# EasyEDA Pro project PWM-24Route.eprj

# Schematic Schematic1
Create Date: 2022-10-05; Page Name: P1; Project Name: PWM-24Route; Schematic Name: Schematic1; Update Date: 2022-10-20
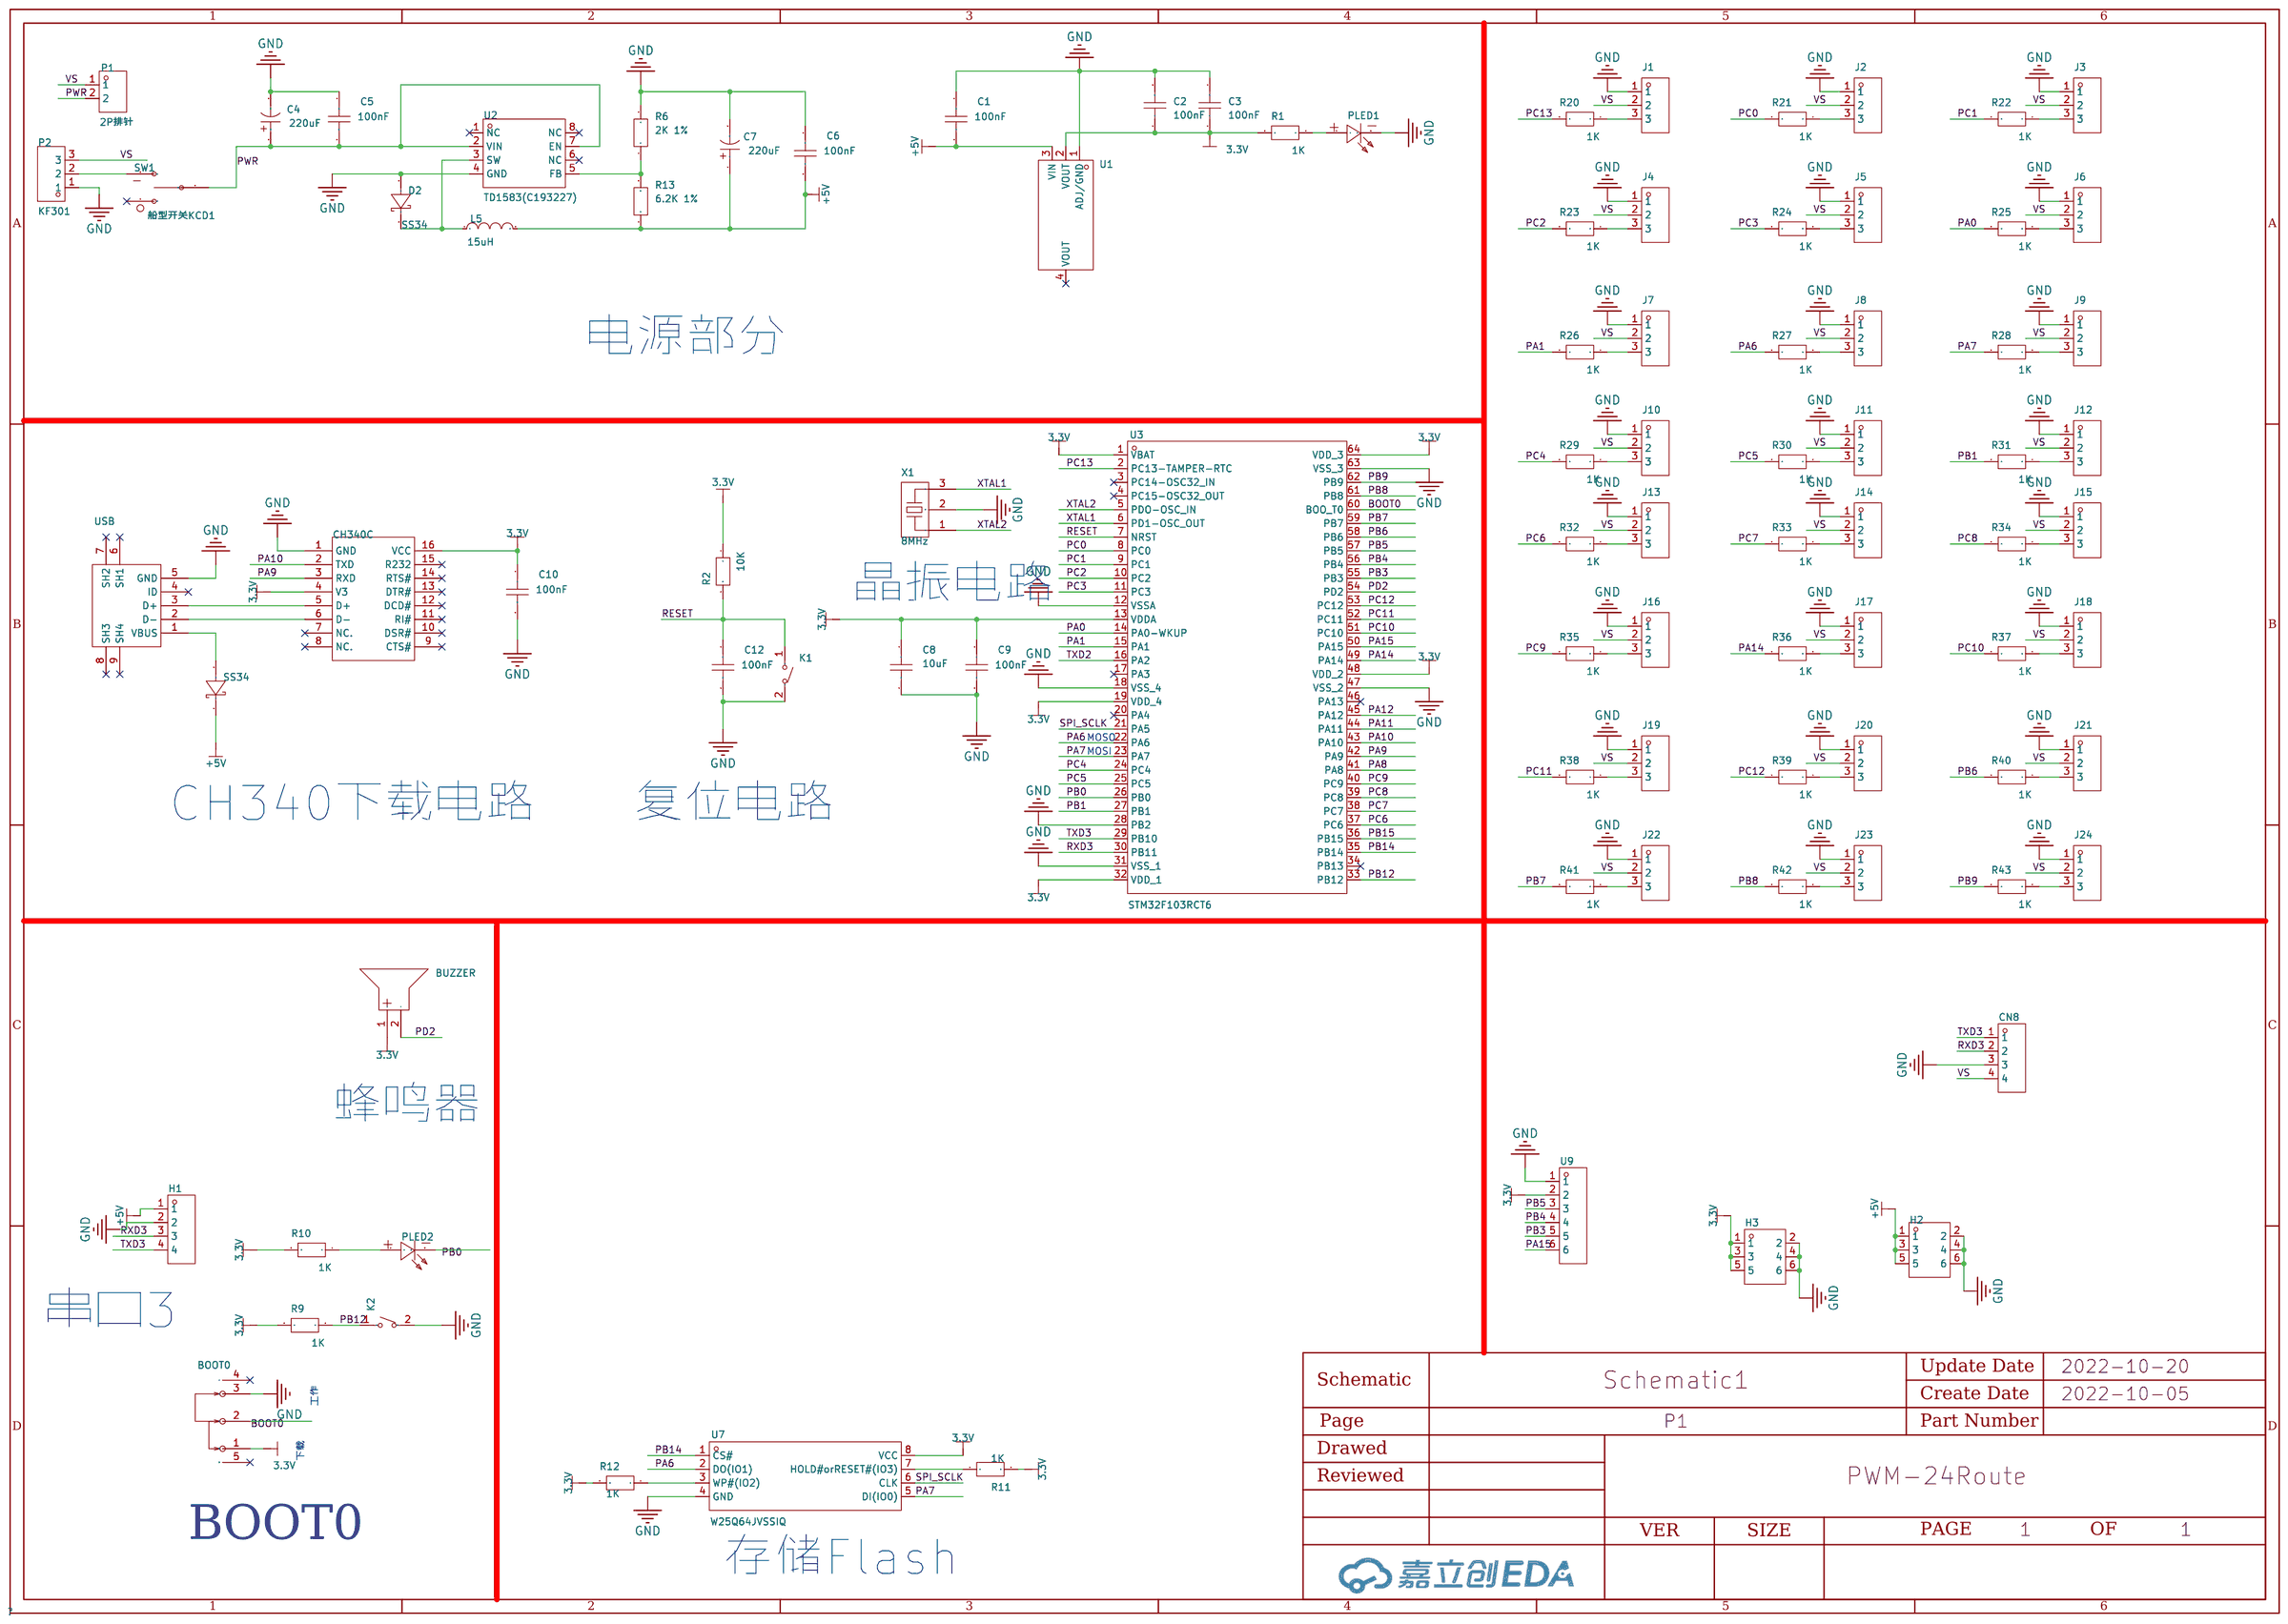
[diagram p0: schematic sheet]

## Parts
BOOT0  SS-12F44-G5  [SW-TH_SS-12F44-G5]
BUZZER  5V,管脚间距8mm,外径10mm,高9.5mm  [9mm宽蜂鸣器]
C1  100nF  [C0603]
C2  100nF  [C0603]
C3  100nF  [C0603]
C4  220uF  [CAP-SMD_BD6.3-L6.6-W6.6-FD]
C5  100nF  [C0603]
C6  100nF  [C0603]
C7  220uF  [CAP-SMD_BD6.3-L6.6-W6.6-FD]
C8  10uF  [C0603]
C9  100nF  [C0603]
C10  100nF  [C0603]
C12  100nF  [C0603]
CH340C  CH340C  [SOP-16_L10.0-W3.9-P1.27-LS6.0-BL]
CN8  HC-5264-4AW  [CONN-TH_4P-P2.50_HCTL_HC-5264-4AW]
D2  SS34  [SMA_L4.3-W2.6-LS5.2-RD]
H1  PM2.54-1*4  [HDR-TH_4P-P2.54-V-F]
H2  PM2.54-2*3  [HDR-TH_6P-P2.54-V-F-R2-C3-S2.54]
H3  PM2.54-2*3  [HDR-TH_6P-P2.54-V-F-R2-C3-S2.54]
J1  TXM_3  [HDR-TH_3P-P2.54-V-M-A]
J2  TXM_3  [HDR-TH_3P-P2.54-V-M-A]
J3  TXM_3  [HDR-TH_3P-P2.54-V-M-A]
J4  TXM_3  [HDR-TH_3P-P2.54-V-M-A]
J5  TXM_3  [HDR-TH_3P-P2.54-V-M-A]
J6  TXM_3  [HDR-TH_3P-P2.54-V-M-A]
J7  TXM_3  [HDR-TH_3P-P2.54-V-M-A]
J8  TXM_3  [HDR-TH_3P-P2.54-V-M-A]
J9  TXM_3  [HDR-TH_3P-P2.54-V-M-A]
J10  TXM_3  [HDR-TH_3P-P2.54-V-M-A]
J11  TXM_3  [HDR-TH_3P-P2.54-V-M-A]
J12  TXM_3  [HDR-TH_3P-P2.54-V-M-A]
J13  TXM_3  [HDR-TH_3P-P2.54-V-M-A]
J14  TXM_3  [HDR-TH_3P-P2.54-V-M-A]
J15  TXM_3  [HDR-TH_3P-P2.54-V-M-A]
J16  TXM_3  [HDR-TH_3P-P2.54-V-M-A]
J17  TXM_3  [HDR-TH_3P-P2.54-V-M-A]
J18  TXM_3  [HDR-TH_3P-P2.54-V-M-A]
J19  TXM_3  [HDR-TH_3P-P2.54-V-M-A]
J20  TXM_3  [HDR-TH_3P-P2.54-V-M-A]
J21  TXM_3  [HDR-TH_3P-P2.54-V-M-A]
J22  TXM_3  [HDR-TH_3P-P2.54-V-M-A]
J23  TXM_3  [HDR-TH_3P-P2.54-V-M-A]
J24  TXM_3  [HDR-TH_3P-P2.54-V-M-A]
K1  KEY  [SW-SMD_L6.0-W3.7-LS8.0]
K2  KEY  [SW-SMD_L6.0-W3.7-LS8.0]
L5  15uH  [IND-SMD_L7.0-W6.6_FXL0630]
P1  2P排针  [HDR-TH_2P-P2.54-V-M-1]
P2  KF301  [CONN-TH_3P-P5.00_KF301-5.0-3P]
PLED1  HSMQ-C191  [LED-SMD_L1.6-W0.8-R-RD]
PLED2  HSMQ-C191  [LED-SMD_L1.6-W0.8-R-RD]
R1  1K  [R0603]
R2  10K  [R0603]
R6  2K 1%  [R0603]
R9  1K  [R0603]
R10  1K  [R0603]
R11  1K  [R0603]
R12  1K  [R0603]
R13  6.2K 1%  [R0603]
R20  1K  [R0603]
R21  1K  [R0603]
R22  1K  [R0603]
R23  1K  [R0603]
R24  1K  [R0603]
R25  1K  [R0603]
R26  1K  [R0603]
R27  1K  [R0603]
R28  1K  [R0603]
R29  1K  [R0603]
R30  1K  [R0603]
R31  1K  [R0603]
R32  1K  [R0603]
R33  1K  [R0603]
R34  1K  [R0603]
R35  1K  [R0603]
R36  1K  [R0603]
R37  1K  [R0603]
R38  1K  [R0603]
R39  1K  [R0603]
R40  1K  [R0603]
R41  1K  [R0603]
R42  1K  [R0603]
R43  1K  [R0603]
SS34  SS34  [SMA_L4.3-W2.6-LS5.2-RD]
SW1  船型开关KCD1  [优信电子10A银触点3脚2档KCD1船型开关带灯]
U1  AMS117-3.3  [SOT-223_L6.5-W3.5-P2.30-LS7.0-BR]
U2  TD1583(C193227)  [SOP-8_L5.0-W4.0-P1.27-LS6.0-BL]
U3  STM32F103RCT6  [LQFP-64_L10.0-W10.0-P0.50-LS12.0-BL]
U7  W25Q64JVSSIQ  [SOIC-8_L5.3-W5.3-P1.27-LS8.0-BL]
U9  双塑单排排针6PIN2.54间距  [HDR-TH_6P-P2.54-V-M-A-1]
USB  MicroXNJ  [MICRO-USB-SMD_MICROXNJ]
X1  8MHz  [OSC-SMD_3P-L3.2-W1.3-P1.2-L]

## Library data of the parts
BOOT0 = SS-12F44-G5_C620367: LCSC Part Name: 拨动开关12.1*5.6*13.9; Supplier Part: C620367; Manufacturer: USAKRO(美韩); Supplier Footprint: 插件,12.1x5.6x13.9mm; Datasheet: https://atta.szlcsc.com/upload/public/pdf/source/20200616/C620367_5E5EC4F271CAA6AC20E19D2721D15308.pdf; Supplier: LCSC
BUZZER = 5V,管脚间距8mm,外径10mm,高9.5mm: Supplier Part: C9900017013; Supplier Footprint: BEEP; Datasheet: https://atta.szlcsc.comnull; Supplier: LCSC
C1-C3 C5 C6 C8-C10 C12 = C0603C104K3RAC: 容值:100nF;精度:±10%;额定电压:25V;温度系数:X7R;; LCSC Part Name: 100nF 25V; Supplier Part: C513334; Manufacturer: KEMET(基美); Supplier Footprint: 0603; Datasheet: https://atta.szlcsc.com/upload/public/pdf/source/20200414/C513334_4E16616BAA774CDA69A580120AB50D87.pdf; Supplier: LCSC; Tolerance: ±10%; Voltage Rated: 25V; Temperature Coefficient: X7R
C4 C7 = RVT220UF16V67RV0015: 容值:220uF;额定电压:16V;工作寿命:2000hrs@105;; LCSC Part Name: 220uF 16V; Supplier Part: C2887273; Manufacturer: KNSCHA(科尼盛); Supplier Footprint: SMD,D6.3xL7.7mm; Datasheet: https://atta.szlcsc.com/upload/public/pdf/source/20210824/3DC9999D9B098FE241E3A26137981C4C.pdf; Supplier: LCSC; Rated Voltage: 16V; Lifetime @ Temp: 2000hrs@105
CH340C = CH340C: 类型:Transceiver;协议类别:USB 2.0;驱动器/接收器数:-;数据速率:2Mbps;; Supplier Part: C84681; Manufacturer: WCH(南京沁恒); Supplier Footprint: SOP-16_150mil; Datasheet: https://atta.szlcsc.com/upload/public/pdf/source/20200819/C84681_ADBED554CE321879DBD6B1D06488689C.pdf; Supplier: LCSC; Type: Transceiver; Protocol: USB 2.0; Data Rate: 2Mbps; Supply Voltage: 3.3V, 5V
CN8 = HC-5264-4AW: 参考系列:-;间距:2.5mm;插针结构:1x4P;排数:1;每排PIN数:4;行距:-;公母:公型插针;安装方式:弯插;额定电流:3A;工作温度范围:-25~+85;; LCSC Part Name: 4P 间距P=2.5mm; Supplier Part: C2845827; Manufacturer: HCTL(华灿天禄); Supplier Footprint: 插件,P=2.5mm; Datasheet: https://atta.szlcsc.com/upload/public/pdf/source/20210728/C2845825_8A371A7E0B3DBB1209B365938FCC7945.pdf; Supplier: LCSC; Pitch: 2.5mm; Pins Structure: 1x4P; Number of Rows: 1; Number of PINs Per Row: 4; Gender: 公型插针; Mounting Style: 弯插; Current Rating (Max): 3A; Operating Temperature Range: -25~+85
D2 SS34 = SS34_C3032484: Supplier Part: C3032484; Manufacturer: TDD(台冠电子); Supplier Footprint: SMA; Datasheet: https://atta.szlcsc.com/upload/public/pdf/source/20220622/9D70D0693761B542BF6F533590093AA5.pdf; Supplier: LCSC
H1 = PM2.54-1*4: 安装类型:直插;; Supplier Part: C5116530; Manufacturer: ZHOURI(洲日); Supplier Footprint: 直插,P=2.54mm; Datasheet: https://atta.szlcsc.com/upload/public/pdf/source/20220729/3385E3C3A9122AF204A83235A2975C64.pdf; Supplier: LCSC; Mounting Type: 直插
H2 H3 = PM2.54-2*3: 安装类型:直插;; Supplier Part: C5116527; Manufacturer: ZHOURI(洲日); Supplier Footprint: 直插,P=2.54mm; Datasheet: https://atta.szlcsc.com/upload/public/pdf/source/20220729/B685A447B6E7D9EA1A3EF6B07540DD20.pdf; Supplier: LCSC; Mounting Type: 直插
J1-J24 = TXM_3: Supplier Part: C9900014923; Supplier Footprint: 排针; Datasheet: https://atta.szlcsc.comnull; Supplier: LCSC
K1 K2 = KEY: Supplier Part: C9900023212; Supplier Footprint: SW-SMD-2P; Datasheet: https://atta.szlcsc.comnull; Supplier: LCSC
L5 = FXL0630-150-M: 电感值:15uH;精度:±20%;额定电流:3A;饱和电流(Isat):4.5A;直流电阻(DCR):104m;; LCSC Part Name: 15uh ±20% 3A 104m; Supplier Part: C177243; Manufacturer: cjiang(长江微电); Supplier Footprint: SMD,0603; Datasheet: https://atta.szlcsc.com/upload/public/pdf/source/20190322/C177243_004B47DCE1D3E0A12FACEEA4F4ACE71C.pdf; Supplier: LCSC; Tolerance: ±20%; Rated Current: 3A; Saturation Current (Isat): 4.5A; DC Resistance (DCR): 104m
P1 = HDR1X2: Supplier Part: C9900014921; Supplier Footprint: 排针; Datasheet: https://atta.szlcsc.comnull; Supplier: LCSC
P2 = KF301-5.0-3P: 间距:5mm;排数:1;每排PIN数:3;安装方式:直针;额定电流:17A;额定电压:250V;线规 - AWG:14~22;线规 - mm?:1.5;工作温度范围:-30~+120;颜色:蓝色;; LCSC Part Name: 5mm 排数:1 每排P数:3 直针 可拼接 铜 环保; Supplier Part: C474882; Manufacturer: KEFA(科发); Supplier Footprint: P=5mm; Datasheet: https://atta.szlcsc.com/upload/public/pdf/source/20200115/C474882_067BD45A25E5311BED9DE634CF3E69D8.pdf; Supplier: LCSC; Pitch: 5mm; Number of Rows: 1; Number of PINs Per Row: 3; Mounting Style: 直针; Current Rating (Max): 17A; Voltage Rating (Max): 250V; Wire Gauge - AWG: 14~22; Wire Gauge - mm?: 1.5; Operating Temperature Range: -30~+120; Color: 蓝色
PLED1 PLED2 = HSMQ-C191: 发光颜色:普绿/黄绿;二极管配置:-;透镜颜色:-;主波长:527nm;峰值波长:520nm;色温:-;光通量(25时):-;测试电流:20mA;正向电压(VF):3.4V;发光强度:145mcd;功率:78mW;发光角度:140°;安装方式:-;工作温度:-40~+85;; LCSC Part Name: 翠绿LED, 贴片; Supplier Part: C188732; Manufacturer: AVAGO(安华高); Supplier Footprint: 0603; Datasheet: https://atta.szlcsc.com/upload/public/pdf/source/20180327/C188732_9425FE8FB3412CC347136B6051CA5524.pdf; Supplier: LCSC; Emitted Color: 普绿/黄绿; Dominant Wavelength: 527nm; Peak Wavelength: 520nm; Forward Current: 20mA; Forward Voltage (VF): 3.4V; Luminous Intensity: 145mcd; Power Dissipation: 78mW; Viewing Angle: 140°; Operating Temperature: -40~+85
R1 R2 R6 R9-R13 R20-R43 = SCR0603F8R06: Supplier Part: C3016465; Manufacturer: VO(翔胜); Supplier Footprint: 0603; Datasheet: https://atta.szlcsc.com/upload/public/pdf/source/20220513/247AF9639BA21CF93567DC289CCC6A22.pdf; Supplier: LCSC
SW1 = KCD11 10*15: Supplier Part: C9900004829; Supplier Footprint: THrough hole; Supplier: LCSC
U1 = AMS1117-3.3_C426566: 输出类型:固定;输出极性:正;输出通道数:1;最大输入电压:18V;输出电压:3.3V;压差:1.4V@(1A);输出电流:1A;电源纹波抑制比(PRSS):70dB@(120Hz);; LCSC Part Name: Vin=18V Vout=3.3V 1A 70dB@(120Hz); Supplier Part: C426566; Manufacturer: Slkor(萨科微); Manufacturer Part: AMS1117-3.3; Supplier Footprint: SOT-223; Datasheet: https://atta.szlcsc.com/upload/public/pdf/source/20201231/C426566_7F22DB93439D00F3FA27143E4F28C6AA.pdf; Supplier: LCSC; Output Type: 固定; Output Polarity: 正; Number of Outputs: 1; Maximum Input Voltage: 18V; Output Voltage: 3.3V; Dropout Voltage: 1.4V@(1A); Output Current: 1A; Power Supply Rejection Ratio (PRSS): 70dB@(120Hz)
U2 = TD1583_C193227: 功能类型:降压型;同步整流:否;输出通道数:1;拓扑结构:降压式;输入电压:3.6V~28V;输出电压:1.222V~26V;输出电流(最大值):3A;开关频率:380kHz;; LCSC Part Name: 降压型 3.6V~28V 3A 380kHz; Supplier Part: C193227; Manufacturer: Techcode(泰德); Manufacturer Part: TD1583; Supplier Footprint: SOP-8_150mil; Datasheet: https://atta.szlcsc.com/upload/public/pdf/source/20180528/C193227_717CB2756CFDF287E4879B380B2F546B.pdf; Supplier: LCSC; Function: 降压型; Synchronous Rectification: 否; Number of Outputs: 1; Topology: 降压式; Input Voltage: 3.6V~28V; Output Voltage: 1.222V~26V; Output Current (Max): 3A; Switching Frequency: 380kHz
U3 = STM32F103RCT6: 主频（MAX):72MHz;工作电压:2V ~ 3.6V;; Supplier Part: C8323; Manufacturer: ST(意法半导体); Supplier Footprint: LQFP-64_10x10x05P; Datasheet: https://atta.szlcsc.com/upload/public/pdf/source/20161130/1480498797345.pdf; Supplier: LCSC; Speed: 72MHz; Voltage - Supply (Vcc/Vdd): 2V ~ 3.6V; Program Memory Size: 256KB; RAM Size: 48KB; Number of I/O: 51; A/D: 16x12bit; D/A: 2x12bit; PWM: 18; LCD: LCD parallel interface, 8080/6800 modes; UART/USART: 3 USART+2 UART; SPI: 3; I2C（SMBUS/PMBUS）: 2; USB Device: 1; CAN: 1
U7 = W25Q64JVSSIQ: 存储器类型:-;存储器构架(格式):-;技术:-;存储器容量:-;时钟频率:-;存储器接口类型:-;; Supplier Part: C179171; Manufacturer: WINBOND(华邦); Supplier Footprint: SOIC-8; Datasheet: https://atta.szlcsc.com/upload/public/pdf/source/20191218/C179171_92C5C91D0324539EDD8F1160D2E79C0F.pdf; Supplier: LCSC
U9 = 双塑单排排针6PIN2.54间距: Supplier Part: C9900029194; Supplier Footprint: SIP-6; Datasheet: https://atta.szlcsc.comnull; Supplier: LCSC
USB = MicroXNJ: 连接器类型:Micro-B;标准:USB 2.0;公母:母座;触点数量:5;端口数量:1;安装方式:卧贴;额定电流 - 电源:1A;工作温度范围:-20~+85;; LCSC Part Name: MICRO USB 母座 小牛角有柱 卷边 编带; Supplier Part: C404969; Manufacturer: SHOU HAN(首韩); Supplier Footprint: SMD; Datasheet: https://atta.szlcsc.com/upload/public/pdf/source/20190722/C404969_F527F22D40F2F6F2B0B236E459D2C165.pdf; Supplier: LCSC; Connector Type: Micro-B; Standard: USB 2.0; Gender: 母座; Number of Contacts: 5; Number of Ports: 1; Mounting Style: 卧贴; Current Rating - Power (Max): 1A; Operating Temperature Range: -20~+85
X1 = CSTCE8M00G15C99-R0: 频率:8MHz;频率容差:±0.1%;内藏负载电容:33pF;谐振阻抗:40;; LCSC Part Name: 8M ±0.1% 33pF; Supplier Part: C110614; Manufacturer: muRata(村田); Supplier Footprint: SMD3213-3P; Datasheet: https://atta.szlcsc.com/upload/public/pdf/source/20180327/C110614_9F5031E08ADB10DE4472527BF78A8CAF.pdf; Supplier: LCSC; Frequency Stability: ±0.13%; Frequency Tolerance: ±0.1%; Built-in Load Capacitance: 33pF; Resonant Impedance: 40; Operating Temperature: -40~+125

## Nets
3.3V: BOOT0.1 BUZZER.1(+) C2.1 C3.2 C8.1 C9.1 C10.1 CH340C.4(V3) CH340C.16(VCC) H3.1 H3.3 H3.5 R1.2 R2.1 R9.2 R10.2 R11.2 R12.2 U1.2(VOUT) U3.1(VBAT) U3.13(VDDA) U3.19(VDD_4) U3.32(VDD_1) U3.48(VDD_2) U3.64(VDD_3) U7.8(VCC) U9.2
+5V: C1.2 C6.2 C7.1 H1.1 H2.1 H2.3 H2.5 L5.2 R13.1 SS34.1(K) U1.3(VIN)
GND: BOOT0.3 C1.1 C2.2 C3.1 C4.2 C5.1 C6.1 C7.2 C8.2 C9.2 C10.2 C12.2 CH340C.1(GND) CN8.3 D2.2(A) H1.2 H2.2 H2.4 H2.6 H3.2 H3.4 H3.6 J1.1 J2.1 J3.1 J4.1 J5.1 J6.1 J7.1 J8.1 J9.1 J10.1 J11.1 J12.1 J13.1 J14.1 J15.1 J16.1 J17.1 J18.1 J19.1 J20.1 J21.1 J22.1 J23.1 J24.1 K1.2 K2.2 P2.1 PLED1.2(C) R6.2 U1.1(ADJ/GND) U2.4(GND) U3.12(VSSA) U3.18(VSS_4) U3.28(PB2) U3.31(VSS_1) U3.47(VSS_2) U3.63(VSS_3) U7.4(GND) U9.1 USB.5(GND) X1.2
BOOT0: BOOT0.2 U3.60(BOO_T0)
PA0: R25.2 U3.14(PA0-WKUP)
PA1: R26.2 U3.15(PA1)
PA6: R27.2 U3.22(PA6) U7.2(DO(IO1))
PA7: R28.2 U3.23(PA7) U7.5(DI(IO0))
PA8: U3.41(PA8)
PA9: CH340C.3(RXD) U3.42(PA9)
PA10: CH340C.2(TXD) U3.43(PA10)
PA11: U3.44(PA11)
PA12: U3.45(PA12)
PA14: R36.2 U3.49(PA14)
PA15: U3.50(PA15) U9.6
PB0: PLED2.2(C) U3.26(PB0)
PB1: R31.2 U3.27(PB1)
PB3: U3.55(PB3) U9.5
PB4: U3.56(PB4) U9.4
PB5: U3.57(PB5) U9.3
PB6: R40.2 U3.58(PB6)
PB7: R41.2 U3.59(PB7)
PB8: R42.2 U3.61(PB8)
PB9: R43.2 U3.62(PB9)
PB12: K2.1 R9.1 U3.33(PB12)
PB14: U3.35(PB14) U7.1(CS#)
PB15: U3.36(PB15)
PC0: R21.2 U3.8(PC0)
PC1: R22.2 U3.9(PC1)
PC2: R23.2 U3.10(PC2)
PC3: R24.2 U3.11(PC3)
PC4: R29.2 U3.24(PC4)
PC5: R30.2 U3.25(PC5)
PC6: R32.2 U3.37(PC6)
PC7: R33.2 U3.38(PC7)
PC8: R34.2 U3.39(PC8)
PC9: R35.2 U3.40(PC9)
PC10: R37.2 U3.51(PC10)
PC11: R38.2 U3.52(PC11)
PC12: R39.2 U3.53(PC12)
PC13: R20.2 U3.2(PC13-TAMPER-RTC)
PD2: BUZZER.2(-) U3.54(PD2)
PWR: C4.1 C5.2 P1.2 SW1.2 U2.2(VIN) U2.7(EN)
RESET: C12.1 K1.1 R2.2 U3.7(NRST)
RXD3: CN8.2 H1.3 U3.30(PB11)
SPI_SCLK: U3.21(PA5) U7.6(CLK)
TXD2: U3.16(PA2)
TXD3: CN8.1 H1.4 U3.29(PB10)
VS: CN8.4 J1.2 J2.2 J3.2 J4.2 J5.2 J6.2 J7.2 J8.2 J9.2 J10.2 J11.2 J12.2 J13.2 J14.2 J15.2 J16.2 J17.2 J18.2 J19.2 J20.2 J21.2 J22.2 J23.2 J24.2 P1.1 P2.3
XTAL1: U3.6(PD1-OSC_OUT) X1.3
XTAL2: U3.5(PDO-OSC_IN) X1.1
$1N1558: D2.1(K) L5.1 U2.3(SW)
$1N1869: R6.1 R13.2 U2.5(FB)
$1N6800: PLED1.1(A) R1.1
$1N8007: SS34.2(A) USB.1(VBUS)
$1N8497: CH340C.6(D-) USB.2(D-)
$1N8517: CH340C.5(D+) USB.3(D+)
$1N28119: PLED2.1(A) R10.1
$1N43465: R12.1 U7.3(WP#(IO2))
$1N43466: R11.1 U7.7(HOLD#orRESET#(IO3))
$1N56275: J1.3 R20.1
$1N57014: J2.3 R21.1
$1N57327: J3.3 R22.1
$1N58153: J4.3 R23.1
$1N58157: J5.3 R24.1
$1N58161: J6.3 R25.1
$1N58832: J7.3 R26.1
$1N58836: J8.3 R27.1
$1N58840: J9.3 R28.1
$1N59511: J10.3 R29.1
$1N59515: J11.3 R30.1
$1N59519: J12.3 R31.1
$1N61585: J13.3 R32.1
$1N61589: J14.3 R33.1
$1N61593: J15.3 R34.1
$1N61597: J16.3 R35.1
$1N61601: J17.3 R36.1
$1N61605: J18.3 R37.1
$1N61609: J19.3 R38.1
$1N61613: J20.3 R39.1
$1N61617: J21.3 R40.1
$1N61621: J22.3 R41.1
$1N61625: J23.3 R42.1
$1N61629: J24.3 R43.1
$1N67150: P2.2 SW1.3

Not connected (* = marked no-connect by the designer): BOOT0 4* 5*; CH340C 7(NC.)* 8(NC.)* 9(CTS#)* 10(DSR#)* 11(RI#)* 12(DCD#)* 13(DTR#)* 14(RTS#)* 15(R232)*; SW1 1*; U1 4(VOUT)*; U2 1(NC)* 6(NC)* 8(NC)*; U3 3(PC14-OSC32_IN)* 4(PC15-OSC32_OUT)* 17(PA3)* 20(PA4)* 34(PB13)* 46(PA13)*; USB 4(ID)* 6(SH1)* 7(SH2)* 8(SH3)* 9(SH4)*

## Notes on the sheet
- 电源部分
- 晶振电路
- MOSO
- MOSI
- CH340下载电路
- 复位电路
- 蜂鸣器
- 串口3
- 工作
- 下载
- BOOT0
- 存储Flash

# Board PCB3
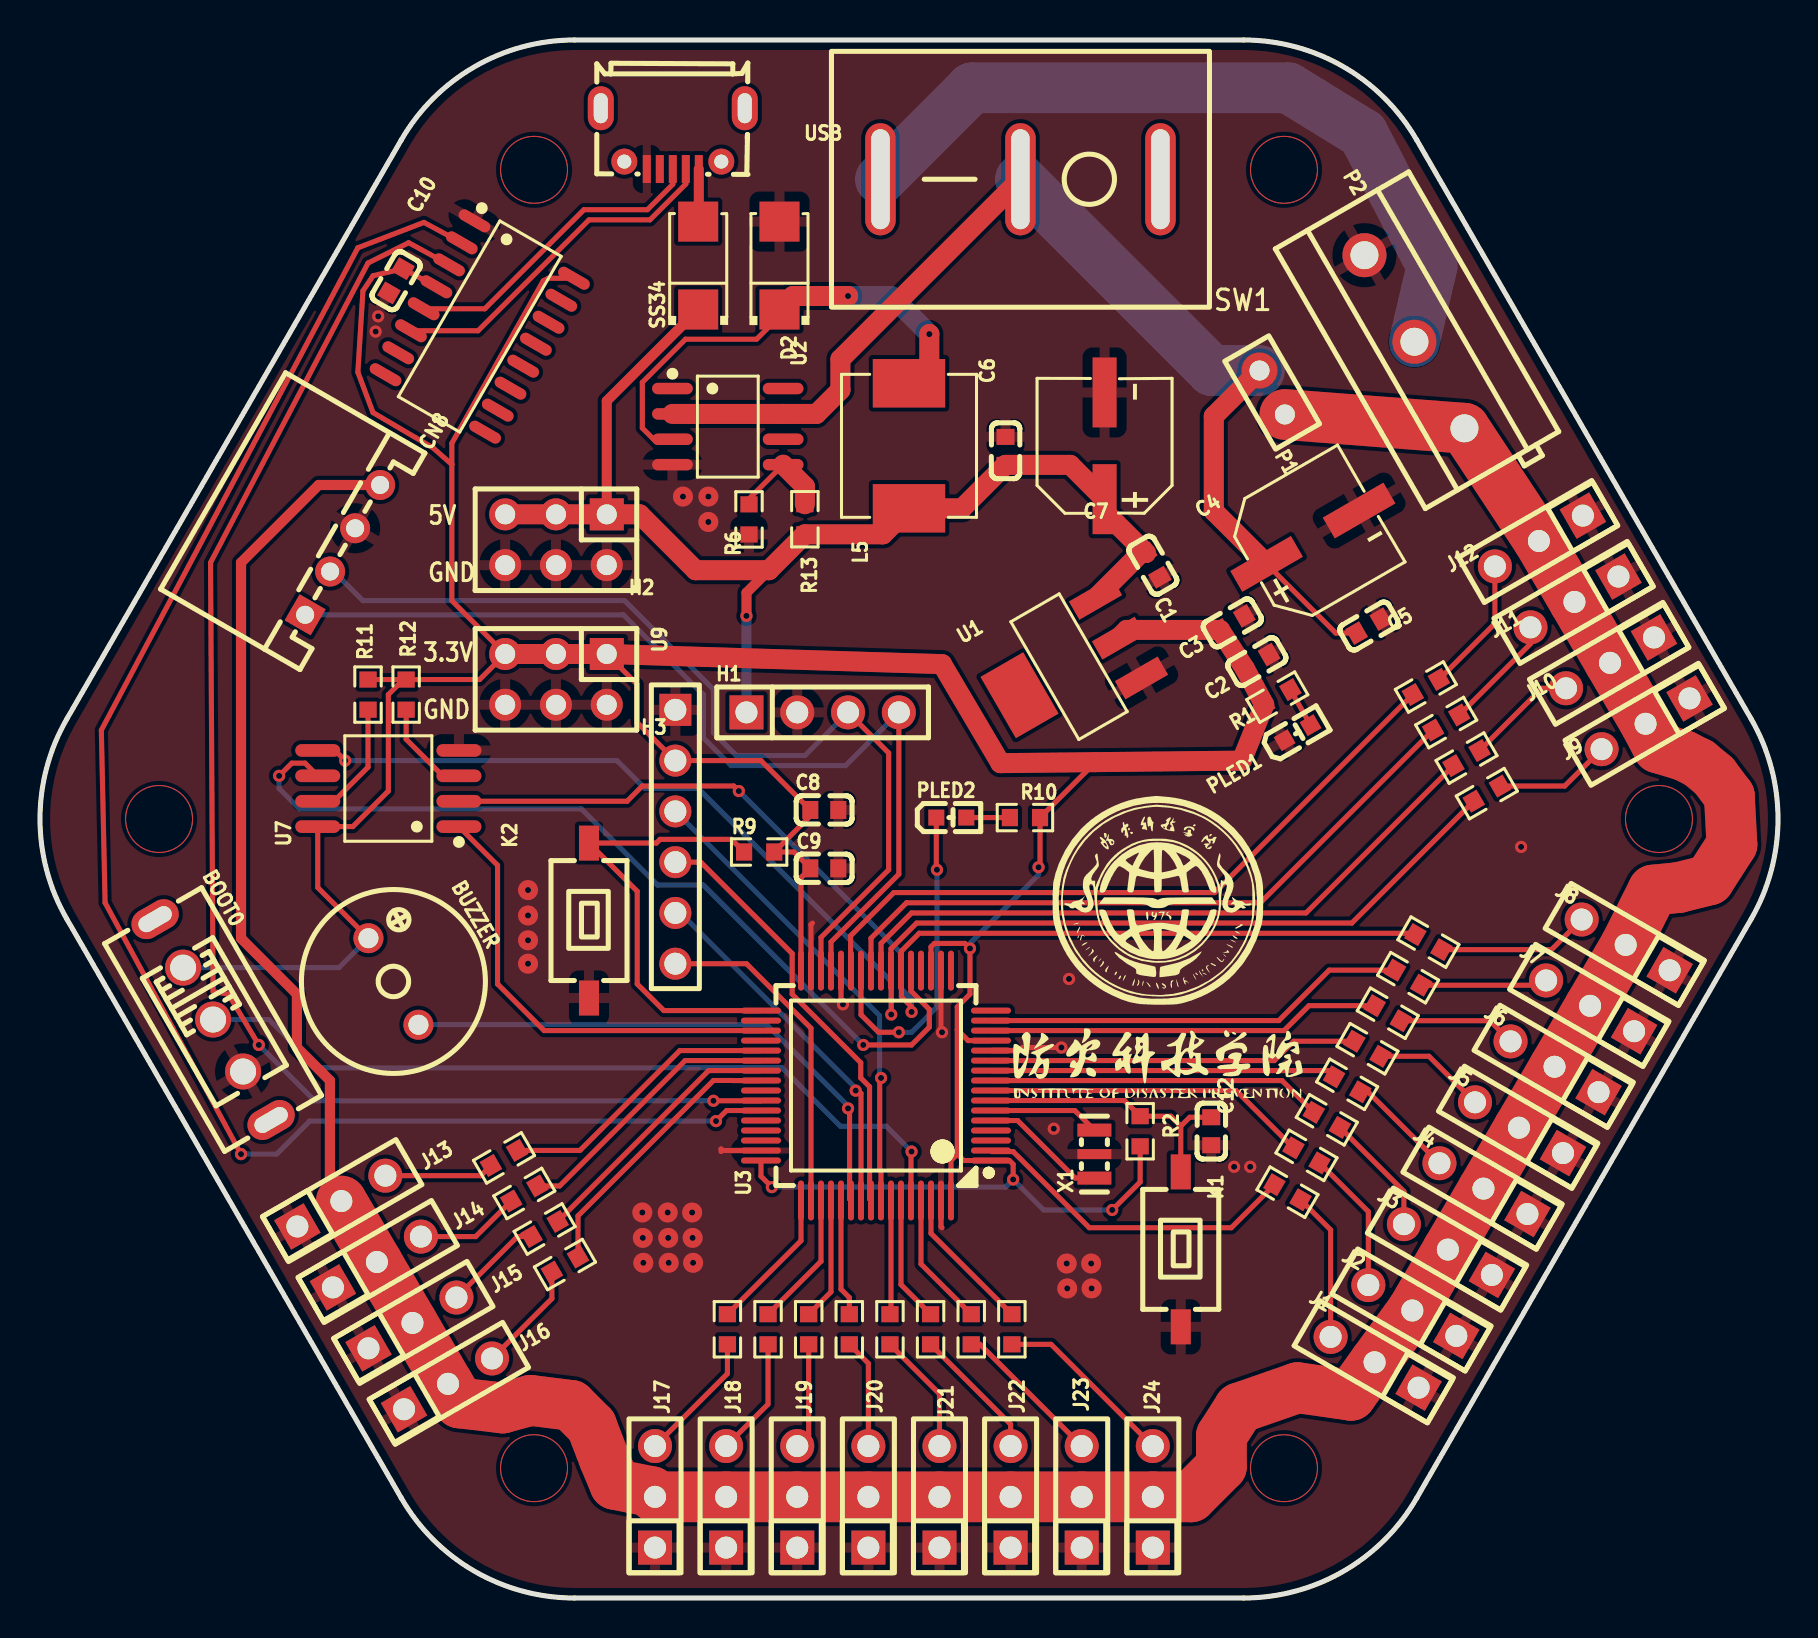
[diagram p1: board, top side]
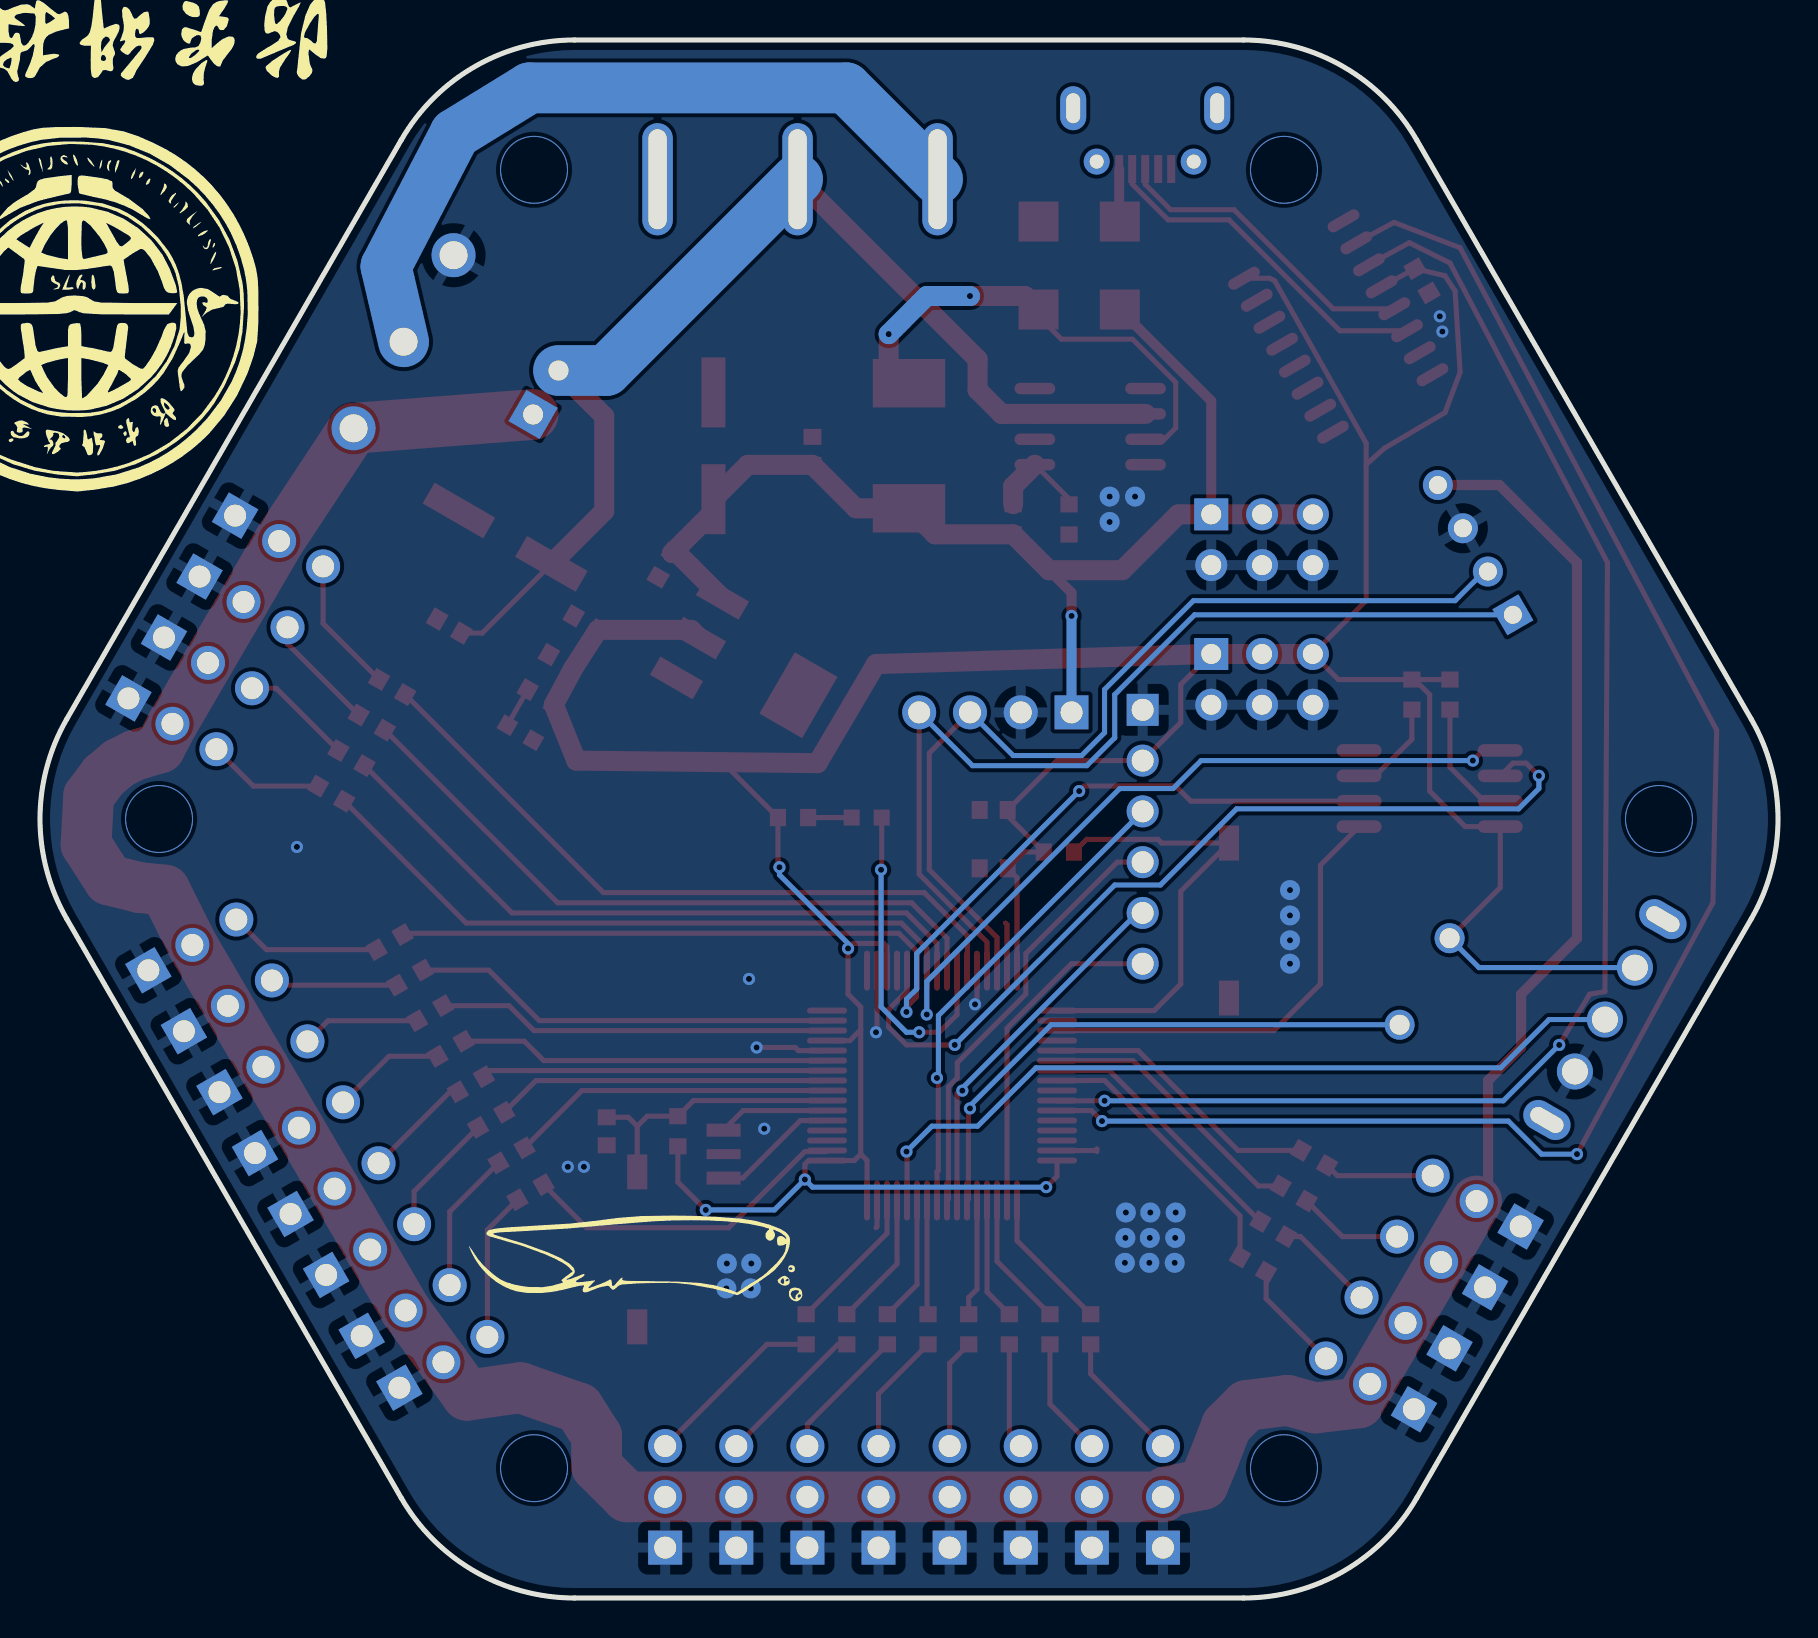
[diagram p2: board, bottom side, seen from below]

Outline 86.91 x 77.94 mm; copper layers: Top Layer, Bottom Layer. Coordinates in mm from the lower left corner of the outline.
Outline path: 1.34,33.97 arc(0,38.97) 1.34,43.97 18.07,72.94 arc(21.73,76.6) 26.73,77.94 60.18,77.94 arc(65.18,76.6) 68.84,72.94 85.57,43.97 arc(86.91,38.97) 85.57,33.97 68.84,5 arc(65.18,1.34) 60.18,0 26.73,0 arc(21.73,1.34) 18.07,5 1.34,33.97
Stack: Top Layer 0.035mm / 介电1 1.51mm FR4 er 4.5 / Bottom Layer 0.035mm

## Design rules (mm)
spacing safeClearance (default): track to track 0.152, other pairs 0.152 to 0.3
track width trackWidth (default): min 0.127, default 0.254, max 2.54
track width trackWidth1: min 0.127, default 2.54, max 2.54
differential pair differentialPair (default): width min 0.127, default 0.254, max 2.54; gap min 0.152, default 0.152
via viaSize (default): diameter min 0.5, default 0.61, max 10; hole min 0.3, default 0.305, max 6
net VS uses trackWidth1

## Placement (name value [footprint] x y rotation side)
BOOT0  SS-12F44-G5  [SW-TH_SS-12F44-G5]  8.65 28.94 300 top
BUZZER  5V,管脚间距8mm,外径10mm,高9.5mm  [9mm宽蜂鸣器]  17.67 30.84 300 top
C1  100nF  [C0603]  55.64 51.67 120 top
C2  100nF  [C0603]  60.85 46.84 30 top
C3  100nF  [C0603]  59.61 48.78 210 top
C4  220uF  [CAP-SMD_BD6.3-L6.6-W6.6-FD]  63.65 53.07 30 top
C5  100nF  [C0603]  66.44 48.62 210 top
C6  100nF  [C0603]  48.28 57.39 270 top
C7  220uF  [CAP-SMD_BD6.3-L6.6-W6.6-FD]  53.23 57.64 90 top
C8  10uF  [C0603]  39.22 39.42 0 top
C9  100nF  [C0603]  39.22 36.5 0 top
C10  100nF  [C0603]  17.8 65.9 240 top
C12  100nF  [C0603]  58.57 23.35 270 top
CH340C  CH340C  [SOP-16_L10.0-W3.9-P1.27-LS6.0-BL]  21.99 63.61 240 top
CN8  HC-5264-4AW  [CONN-TH_4P-P2.50_HCTL_HC-5264-4AW]  15.13 52.43 240 top
D2  SS34  [SMA_L4.3-W2.6-LS5.2-RD]  36.98 66.66 90 top
H1  PM2.54-1*4  [HDR-TH_4P-P2.54-V-F]  39.13 44.31 0 top
H2  PM2.54-2*3  [HDR-TH_6P-P2.54-V-F-R2-C3-S2.54]  25.8 52.94 180 top
H3  PM2.54-2*3  [HDR-TH_6P-P2.54-V-F-R2-C3-S2.54]  25.8 45.96 180 top
J1  TXM_3  [HDR-TH_3P-P2.54-V-M-A]  66.73 11.79 150 top
J2  TXM_3  [HDR-TH_3P-P2.54-V-M-A]  68.62 14.38 150 top
J3  TXM_3  [HDR-TH_3P-P2.54-V-M-A]  70.4 17.43 150 top
J4  TXM_3  [HDR-TH_3P-P2.54-V-M-A]  72.18 20.48 150 top
J5  TXM_3  [HDR-TH_3P-P2.54-V-M-A]  73.95 23.53 150 top
J6  TXM_3  [HDR-TH_3P-P2.54-V-M-A]  75.73 26.58 150 top
J7  TXM_3  [HDR-TH_3P-P2.54-V-M-A]  77.51 29.62 150 top
J8  TXM_3  [HDR-TH_3P-P2.54-V-M-A]  79.29 32.67 150 top
J9  TXM_3  [HDR-TH_3P-P2.54-V-M-A]  80.28 43.73 210 top
J10  TXM_3  [HDR-TH_3P-P2.54-V-M-A]  78.5 46.78 210 top
J11  TXM_3  [HDR-TH_3P-P2.54-V-M-A]  76.73 49.83 210 top
J12  TXM_3  [HDR-TH_3P-P2.54-V-M-A]  74.95 52.88 210 top
J13  TXM_3  [HDR-TH_3P-P2.54-V-M-A]  15.07 19.86 30 top
J14  TXM_3  [HDR-TH_3P-P2.54-V-M-A]  16.85 16.81 30 top
J15  TXM_3  [HDR-TH_3P-P2.54-V-M-A]  18.62 13.76 30 top
J16  TXM_3  [HDR-TH_3P-P2.54-V-M-A]  20.4 10.71 30 top
J17  TXM_3  [HDR-TH_3P-P2.54-V-M-A]  30.75 5.06 90 top
J18  TXM_3  [HDR-TH_3P-P2.54-V-M-A]  34.31 5.06 90 top
J19  TXM_3  [HDR-TH_3P-P2.54-V-M-A]  37.86 5.06 90 top
J20  TXM_3  [HDR-TH_3P-P2.54-V-M-A]  41.42 5.06 90 top
J21  TXM_3  [HDR-TH_3P-P2.54-V-M-A]  44.98 5.06 90 top
J22  TXM_3  [HDR-TH_3P-P2.54-V-M-A]  48.53 5.06 90 top
J23  TXM_3  [HDR-TH_3P-P2.54-V-M-A]  52.09 5.06 90 top
J24  TXM_3  [HDR-TH_3P-P2.54-V-M-A]  55.64 5.06 90 top
K1  KEY  [SW-SMD_L6.0-W3.7-LS8.0]  57.04 17.44 270 top
K2  KEY  [SW-SMD_L6.0-W3.7-LS8.0]  27.45 33.89 270 top
L5  15uH  [IND-SMD_L7.0-W6.6_FXL0630]  43.45 57.64 90 top
P1  2P排针  [HDR-TH_2P-P2.54-V-M-1]  61.61 60.31 120 top
P2  KF301  [CONN-TH_3P-P5.00_KF301-5.0-3P]  68.73 62.85 300 top
PLED1  HSMQ-C191  [LED-SMD_L1.6-W0.8-R-RD]  62.88 43.29 30 top
PLED2  HSMQ-C191  [LED-SMD_L1.6-W0.8-R-RD]  45.57 39.04 0 top
R1  1K  [R0603]  61.87 45.07 210 top
R2  10K  [R0603]  55.01 23.35 90 top
R6  2K 1%  [R0603]  35.45 53.96 270 top
R9  1K  [R0603]  35.96 37.32 0 top
R10  1K  [R0603]  49.25 39.04 0 top
R11  1K  [R0603]  16.4 45.19 90 top
R12  1K  [R0603]  18.31 45.19 90 top
R13  6.2K 1%  [R0603]  38.25 53.97 90 top
R20  1K  [R0603]  62.38 20.3 150 top
R21  1K  [R0603]  63.33 22.14 150 top
R22  1K  [R0603]  64.34 23.92 150 top
R23  1K  [R0603]  65.36 25.7 150 top
R24  1K  [R0603]  66.38 27.48 150 top
R25  1K  [R0603]  67.39 29.26 150 top
R26  1K  [R0603]  68.41 31.03 150 top
R27  1K  [R0603]  69.42 32.81 150 top
R28  1K  [R0603]  72.35 40.24 210 top
R29  1K  [R0603]  71.33 42.02 210 top
R30  1K  [R0603]  70.31 43.8 210 top
R31  1K  [R0603]  69.3 45.58 210 top
R32  1K  [R0603]  23.2 22.02 210 top
R33  1K  [R0603]  24.22 20.24 30 top
R34  1K  [R0603]  25.23 18.46 30 top
R35  1K  [R0603]  26.25 16.68 30 top
R36  1K  [R0603]  34.37 13.44 90 top
R37  1K  [R0603]  36.4 13.44 90 top
R38  1K  [R0603]  38.44 13.44 90 top
R39  1K  [R0603]  40.47 13.44 90 top
R40  1K  [R0603]  42.5 13.44 90 top
R41  1K  [R0603]  44.53 13.44 90 top
R42  1K  [R0603]  46.56 13.44 90 top
R43  1K  [R0603]  48.6 13.44 90 top
SS34  SS34  [SMA_L4.3-W2.6-LS5.2-RD]  32.91 66.66 90 top
SW1  船型开关KCD1  [优信电子10A银触点3脚2档KCD1船型开关带灯]  56.03 70.98 180 top
U1  AMS117-3.3  [SOT-223_L6.5-W3.5-P2.30-LS7.0-BR]  51.45 46.59 30 top
U2  TD1583(C193227)  [SOP-8_L5.0-W4.0-P1.27-LS6.0-BL]  34.39 58.6 270 top
U3  STM32F103RCT6  [LQFP-64_L10.0-W10.0-P0.50-LS12.0-BL]  41.8 25.64 90 top
U7  W25Q64JVSSIQ  [SOIC-8_L5.3-W5.3-P1.27-LS8.0-BL]  17.42 40.5 90 top
U9  双塑单排排针6PIN2.54间距  [HDR-TH_6P-P2.54-V-M-A-1]  31.77 38.08 270 top
USB  MicroXNJ  [MICRO-USB-SMD_MICROXNJ]  31.64 73.01 180 top
X1  8MHz  [OSC-SMD_3P-L3.2-W1.3-P1.2-L]  52.72 22.21 90 top

## Footprints (pads in the part's own frame, mm; a bottom-side part is the same pattern mirrored in y, then rotated)
9mm宽蜂鸣器
  round 1.5 hole 1: 1(-2.5,0) 2(2.5,0)
C0603
  rect 0.8x0.9 smd: 1(-0.7,0) 2(0.7,0)
CAP-SMD_BD6.3-L6.6-W6.6-FD
  rect 3.5x1.2 smd: 1(-2.67,0) 2(2.67,0)
CONN-TH_3P-P5.00_KF301-5.0-3P
  round 2.2 hole 1.399: 1(-4.998,0) 2(0,0) 3(5.002,0)
CONN-TH_4P-P2.50_HCTL_HC-5264-4AW
  rect 1.5x1.5 hole 0.9: 1(3.75,0)
  round 1.5 hole 0.9: 2(1.25,0) 3(-1.25,0) 4(-3.75,0)
HDR-TH_2P-P2.54-V-M-1
  rect 1.8x1.8 hole 1: 1(-1.27,0)
  round 1.8 hole 1: 2(1.27,0)
HDR-TH_3P-P2.54-V-M-A
  rect 1.7x1.7 hole 1.1: 1(-2.54,0)
  round 1.7 hole 1.1: 2(0,0) 3(2.54,0)
HDR-TH_4P-P2.54-V-F
  rect 1.7x1.7 hole 1.1: 1(-3.81,0)
  round 1.7 hole 1.1: 2(-1.27,0) 3(1.27,0) 4(3.81,0)
HDR-TH_6P-P2.54-V-F-R2-C3-S2.54
  rect 1.7x1.6 hole 1: 1(-2.54,-1.27)
  round 1.6 hole 1: 2(-2.54,1.27) 3(0,-1.27) 4(0,1.27) 5(2.54,-1.27) 6(2.54,1.27)
HDR-TH_6P-P2.54-V-M-A-1
  rect 1.6x1.6 hole 1.1: 1(-6.35,0)
  round 1.6 hole 1.1: 2(-3.81,0) 3(-1.27,0) 4(1.27,0) 5(3.81,0) 6(6.35,0)
IND-SMD_L7.0-W6.6_FXL0630
  rect 2.423x3.619 smd: 1(3.13,0) 2(-3.127,0)
LED-SMD_L1.6-W0.8-R-RD
  rect 0.8x0.8 smd: 1(0.75,0) 2(-0.75,0)
LQFP-64_L10.0-W10.0-P0.50-LS12.0-BL
  oval 0.3x2 smd: 1(-3.75,-5.75) 2(-3.25,-5.75) 3(-2.75,-5.75) 4(-2.25,-5.75) 5(-1.75,-5.75) 6(-1.25,-5.75) 7(-0.75,-5.75) 8(-0.25,-5.75) 9(0.25,-5.75) 10(0.75,-5.75) 11(1.25,-5.75) 12(1.75,-5.75) 13(2.25,-5.75) 14(2.75,-5.75) 15(3.25,-5.75) 16(3.75,-5.75) 33(3.75,5.75) 34(3.25,5.75) 35(2.75,5.75) 36(2.25,5.75) 37(1.75,5.75) 38(1.25,5.75) 39(0.75,5.75) 40(0.25,5.75) 41(-0.25,5.75) 42(-0.75,5.75) 43(-1.25,5.75) 44(-1.75,5.75) 45(-2.25,5.75) 46(-2.75,5.75) 47(-3.25,5.75) 48(-3.75,5.75)
  oval 2x0.3 smd: 17(5.75,-3.75) 18(5.75,-3.25) 19(5.75,-2.75) 20(5.75,-2.25) 21(5.75,-1.75) 22(5.75,-1.25) 23(5.75,-0.75) 24(5.75,-0.25) 25(5.75,0.25) 26(5.75,0.75) 27(5.75,1.25) 28(5.75,1.75) 29(5.75,2.25) 30(5.75,2.75) 31(5.75,3.25) 32(5.75,3.75) 49(-5.75,3.75) 50(-5.75,3.25) 51(-5.75,2.75) 52(-5.75,2.25) 53(-5.75,1.75) 54(-5.75,1.25) 55(-5.75,0.75) 56(-5.75,0.25) 57(-5.75,-0.25) 58(-5.75,-0.75) 59(-5.75,-1.25) 60(-5.75,-1.75) 61(-5.75,-2.25) 62(-5.75,-2.75) 63(-5.75,-3.25) 64(-5.75,-3.75)
MICRO-USB-SMD_MICROXNJ
  rect 0.4x1.4 smd: 1(-1.3,1.522) 2(-0.65,1.522) 3(0,1.522) 4(0.65,1.522) 5(1.3,1.522)
  round 1.3 hole 0.7: 6(2.425,1.149) 9(-2.425,1.149)
  oval 1.3x2.2 hole 0.7x1.5: 7(3.6,-1.522) 8(-3.6,-1.522)
OSC-SMD_3P-L3.2-W1.3-P1.2-L
  rect 0.65x1.7 smd: 1(-1.199,0) 3(1.199,0)
  rect 0.5x1.7 smd: 2(0,0)
R0603
  rect 0.806x0.864 smd: 1(-0.753,0) 2(0.753,0)
SMA_L4.3-W2.6-LS5.2-RD
  rect 2x2 smd: 1(-2.2,0) 2(2.2,0)
SOIC-8_L5.3-W5.3-P1.27-LS8.0-BL
  oval 0.63x2.25 smd: 1(-1.905,-3.53) 2(-0.635,-3.53) 3(0.635,-3.53) 4(1.905,-3.53) 5(1.905,3.53) 6(0.635,3.53) 7(-0.635,3.53) 8(-1.905,3.53)
SOP-8_L5.0-W4.0-P1.27-LS6.0-BL
  oval 0.574x2.035 smd: 1(-1.905,-2.768) 2(-0.635,-2.768) 3(0.635,-2.768) 4(1.905,-2.768) 5(1.905,2.768) 6(0.635,2.768) 7(-0.635,2.768) 8(-1.905,2.768)
SOP-16_L10.0-W3.9-P1.27-LS6.0-BL
  oval 0.56x1.745 smd: 1(-4.445,-2.873) 2(-3.175,-2.873) 3(-1.905,-2.873) 4(-0.635,-2.873) 5(0.635,-2.873) 6(1.905,-2.873) 7(3.175,-2.873) 8(4.445,-2.873) 9(4.445,2.873) 10(3.175,2.873) 11(1.905,2.873) 12(0.635,2.873) 13(-0.635,2.873) 14(-1.905,2.873) 15(-3.175,2.873) 16(-4.445,2.873)
SOT-223_L6.5-W3.5-P2.30-LS7.0-BR
  rect 2.465x1.05 smd: 1(2.858,-2.3) 2(2.857,0) 3(2.857,2.3)
  rect 2.465x3.54 smd: 4(-2.857,0)
SW-SMD_L6.0-W3.7-LS8.0
  rect 1.75x1.001 smd: 1(-3.876,0) 2(3.876,0)
SW-TH_SS-12F44-G5
  round 1.801 hole 1.3: 1(-2.999,0) 2(0,0) 3(2.999,0)
  oval 1.501x2.499 hole 0.8x1.801: 4(5.801,0) 5(-5.799,0)
优信电子10A银触点3脚2档KCD1船型开关带灯
  oval 1.524x5.61 hole 0.914x5: 1(0,0) 2(7,0) 3(14,0)

## Nets
As in the schematic.

Pads without a net: BOOT0 4 5; CH340C 7 8 9 10 11 12 13 14 15; SW1 1; U1 4; U2 1 6 8; U3 3 4 17 20 34 46; USB 4 6 7 8 9

## Via types
v1: diameter 3.4, hole 3.3, Top Layer to Bottom Layer, 6 vias
v2: diameter 1, hole 0.305, Top Layer to Bottom Layer, 22 vias
v3: diameter 0.61, hole 0.305, Top Layer to Bottom Layer, 32 vias

## Routing (per net, layer and track width the routed paths; a pad name or vN(x,y) marks a point on that pad's centre or on a via; arc(x,y) is an arc through that point)
3.3V: length 206
  Top Layer w0.254: H3.1 29.86,45.7 29.86,43.8 U9.2 36.05,41.89 C8.1 38.52,39.12 R9.2 37.7,37.32 C9.1 38.05,36.04 U3.32 ; 45.87,22.21 45.87,28.43 ; 45.87,22.21 45.55,21.89 45.55,19.89 ; 45.87,22.21 46.19,21.89 U3.1 48.47,21.89 48.66,21.7 v3(48.66,20.94) ; 45.87,28.43 46.41,27.89 U3.13 ; 45.87,28.43 45.87,29.57 46.5,30.21 v3(46.5,32.49) 46.25,32.75 44.72,32.75 44.55,32.58 U3.19 ; 20.59,56.71 19.67,57.53 16.65,59.3 15.89,61.32 16.15,65.39 16.66,66.15 C10.1 19.82,65.59 ; 20.59,56.71 20.59,57.77 25.16,65.9 25.42,66.02 CH340C.16 ; 20.59,56.71 20.59,49.89 23.26,47.23 21.98,45.95 R12.2 18.17,45.95 ; 52.75,41.81 52.75,41.79 R10.2 50,36.63 v3(49.93,36.56) ; 18.17,45.95 R11.2 ; 18.17,45.95 17.42,45.19 17.42,40.37 15.64,38.59 U7.8 13.89,35.54 16.42,33.01 ; v3(53.61,19.41) 55.01,20.81 R2.1 ; v3(36.59,20.56) 36.05,21.1 U3.48
  Top Layer w1: U1.2 54.34,48.43 C3.2 C2.1 R1.2 60.09,41.89 52.75,41.81 48.02,41.77 45.1,46.72 H3.1 H3.3 23.26,47.23
  Bottom Layer w0.254: BOOT0.1 14.95,31.54 16.42,33.01 ; v3(46.5,32.49) 46.5,32.75 49.93,36.18 v3(49.93,36.56) ; v3(53.61,19.41) 50.18,19.41 v3(48.66,20.94) 48.28,20.56 v3(36.59,20.56)
+5V: length 60.7
  Top Layer w0.5: v3(35.32,49.13) 35.32,50.29 36.45,51.42 ; SS34.1 28.34,59.89 H2.1
  Top Layer w1: 23.26,54.21 H2.3 H2.1 29.99,54.21 32.78,51.42 36.45,51.42 38.25,53.21 42.15,53.21 L5.2 46.11,54.51 C6.2 51.52,56.69 C7.1 53.23,54.34 C1.2 55.04,52.28 U1.3
  Bottom Layer w0.5: H1.1 v3(35.32,49.13)
GND: length 14.6
  Top Layer w0.254: U3.31 38.55,33.69 38.63,33.76 ; 45.05,19.89 45.05,18.58 45.1,18.52 ; 45.05,28.25 v3(45.1,28.3) ; 45.05,28.25 U3.18 ; 45.05,28.25 45.05,28.23 ; U3.12 48.98,27.39 49.14,27.54 v3(51.07,27.54) ; U3.47 34.13,22.39 34.05,22.46 34.05,22.33 ; U3.28 40.05,29.8 v3(40.15,29.7)
  Bottom Layer w0.254: v3(40.15,29.7) 40.28,29.7
  vias: v2(24.4,35.42) v2(24.4,34.15) v2(24.4,32.9) v2(24.4,31.73) v2(30.12,19.29) v2(30.14,18.02) v2(30.17,16.77) v2(31.39,19.29) v2(31.41,18.02) v2(31.44,16.77) v2(32.15,55.1) v2(32.61,19.29) v2(32.63,18.02) v2(32.66,16.77) v2(33.42,55.1) v2(33.42,53.83) v2(51.34,16.73) v2(51.36,15.49) v2(52.56,16.73) v2(52.58,15.49) v3(16.78,63.36) v3(16.91,64.12) v3(50.69,23.48) v3(51.45,30.97) v3(59.71,21.57) v3(60.51,21.57) v3(74.06,37.57)
(no net):
  vias: v1(5.95,38.97) v1(24.7,71.45) v1(24.7,6.5) v1(62.2,71.45) v1(62.2,6.5) v1(80.95,38.97)
BOOT0: length 40.3
  Top Layer w0.254: 43.55,19.89 43.55,22.31 v3(43.58,22.33)
  Bottom Layer w0.254: 43.45,22.46 v3(43.58,22.33) 42.31,23.6 40.02,23.6 37.1,26.53 13.86,26.53 11.45,28.94 BOOT0.2
PA0: length 19.7
  Top Layer w0.254: 66.74,29.63 63.45,29.63 62.2,28.39 U3.14
PA1: length 21.2
  Top Layer w0.254: 67.76,31.41 64.47,31.41 61.94,28.89 U3.15
PA6: length 58.4
  Top Layer w0.254: U7.2 29.36,39.86 30.12,40.62 34.69,40.62 v3(34.94,40.37) ; v3(43.58,29.32) 43.58,29.57 43.07,30.08 43.07,31.37 U3.22 43.07,31.41 43.07,32.36 43.96,33.26 68.7,33.26 68.77,33.19
  Bottom Layer w0.254: v3(34.94,40.37) 43.07,32.24 43.07,30.46 43.58,29.95 v3(43.58,29.32)
PA7: length 70.6
  Top Layer w0.254: U7.5 14.75,42.4 v3(15.26,41.89) ; v3(42.56,29.19) 42.56,31.37 U3.23 42.55,32.48 43.83,33.76 65.59,33.76 R28.2
  Bottom Layer w0.254: v3(42.56,29.19) 42.56,30.84 32.91,40.5 30.24,40.5 28.85,41.89 v3(15.26,41.89)
PA9: length 73
  Top Layer w0.254: CH340C.3 18.43,67.8 16.4,66.78 8.53,51.8 8.65,30.34 9.42,30.21 v3(10.94,27.67) ; U3.42 36.04,24.87 v3(33.67,24.87)
  Bottom Layer w0.254: v3(33.67,24.87) 13.73,24.87 v3(10.94,27.67)
PA10: length 83
  Top Layer w0.254: CH340C.2 19.2,68.82 15.89,67.55 3.07,43.42 3.26,34.78 v3(10.05,22.21) ; U3.43 34.33,24.39 v3(33.8,23.86)
  Bottom Layer w0.254: v3(33.8,23.86) 13.48,23.86 11.83,22.21 v3(10.05,22.21) 9.92,22.33
PA14: length 7.2
  Top Layer w0.254: 38.05,19.89 38.05,17.88 R36.2
PA15: length 16.7
  Top Layer w0.254: 31.77,31.73 35.32,31.73 38.55,28.51 38.55,19.89
PB0: length 16.4
  Top Layer w0.254: v3(42.94,28.3) 41.93,28.3 41.05,29.18 U3.26 ; PLED2.2 44.82,36.46 v3(44.85,36.43)
  Bottom Layer w0.254: v3(42.94,28.3) 43.58,28.3 44.85,29.57 v3(44.85,36.43)
PB1: length 34.2
  Top Layer w0.254: 40.53,32.04 40.53,33.13 42.69,35.29 58.73,35.29 R31.2
PB3: length 18.5
  Top Layer w0.254: 41.05,19.89 41.05,25.24 40.91,25.38 v3(40.79,25.38)
  Bottom Layer w0.254: U9.5 32.02,34.27 40.79,25.51 v3(40.79,25.38)
PB4: length 21.7
  Top Layer w0.254: 31.77,36.81 33.04,36.81 37.61,32.24 37.61,30.21 41.04,26.78 41.04,26.02 41.48,25.58 41.48,19.96 41.55,19.89
PB5: length 23.8
  Top Layer w0.254: 42.05,19.89 42.05,21.32 41.99,21.38 41.99,26.02 v3(42.06,26.02)
  Bottom Layer w0.254: U9.3 41.98,29.14 41.98,26.09 v3(42.06,26.02)
PB6: length 5.7
  Top Layer w0.254: R40.2 42.55,14.25 42.55,19.89
PB7: length 6.3
  Top Layer w0.254: 43.05,19.89 43.05,15.68 R41.2
PB8: length 6.7
  Top Layer w0.254: 44.05,19.89 44.05,16.71 R42.2
PB9: length 7.4
  Top Layer w0.254: R43.2 44.55,18.24 44.55,19.89
PB12: length 22.9
  Top Layer w0.254: R9.1 34.57,37.95 31.01,37.95 30.82,37.77 K2.1 29.86,35.35 29.86,30.72 31.19,29.39 U3.33
PB14: length 22.8
  Top Layer w0.254: U3.35 25.21,28.39 22.88,30.72 22.88,36.66 U7.1
PC0: length 16.3
  Top Layer w0.254: U3.8 59.81,25.39 62.68,22.52
PC1: length 16.8
  Top Layer w0.254: U3.9 62.1,25.89 63.69,24.3
PC2: length 17.3
  Top Layer w0.254: U3.10 64.4,26.39 64.71,26.08
PC3: length 18.6
  Top Layer w0.254: U3.11 61.72,26.89 62.69,27.85 65.72,27.85
PC4: length 32.8
  Top Layer w0.254: 42.06,32.28 42.06,32.75 43.58,34.27 63.31,34.27 R29.2
PC5: length 34
  Top Layer w0.254: U3.25 41.55,33.01 43.33,34.78 61.02,34.78 R30.2
PC6: length 14.3
  Top Layer w0.254: 23.85,22.39 27,22.39 31.99,27.39 U3.37
PC7: length 13.8
  Top Layer w0.254: U3.38 32.26,26.89 25.99,20.62 R33.2
PC8: length 13.3
  Top Layer w0.254: R34.2 33.43,26.39 U3.39
PC9: length 14
  Top Layer w0.254: R35.2 26.9,19.12 33.67,25.89 34.62,25.89 34.62,25.89 U3.40
PC10: length 6.8
  Top Layer w0.254: R37.2 39.05,16.84 39.05,19.89
PC11: length 6.2
  Top Layer w0.254: R38.2 39.55,15.31 39.55,19.89
PC12: length 5.9
  Top Layer w0.254: R39.2 40.47,15.03 40.05,15.45 40.05,19.89
PC13: length 16.7
  Top Layer w0.254: R20.2 59.57,18.52 52.47,18.52 48.66,22.33 47.6,22.33 U3.2
PD2: length 28.1
  Top Layer w0.254: 40.55,19.89 40.48,19.96 40.48,24.42 v3(40.4,24.49)
  Bottom Layer w0.254: v3(40.4,24.49) 40.53,24.49 36.35,28.68 18.92,28.68
PWR: length 56.7
  Top Layer w0.254: C4.1 64.79,48.27 C5.2
  Top Layer w1: P1.2 58.69,59.12 58.69,54.37 C4.1 ; U2.2 U2.7 38.83,59.24 40.02,60.43 40.02,61.97 SW1.2
  Bottom Layer w2.54: P1.2 58.59,61.41 SW1.2
RESET: length 14
  Top Layer w0.254: C12.1 57.49,24.05 57.04,23.6 ; U3.7 54.23,24.89 R2.2 56.54,24.1 57.04,23.6 ; 57.04,23.6 K1.1
RXD3: length 47
  Top Layer w0.254: U3.30 39.05,33.05 42.44,36.43 42.44,42.27 H1.3
  Bottom Layer w0.254: H1.3 38.25,42.15 34.82,42.15 33.67,43.29 33.67,45.45 29.23,49.89 16.15,49.89 14.69,51.35 CN8.2
SPI_SCLK: length 44.6
  Top Layer w0.254: v3(11.96,41.13) 12.59,41.77 13.25,41.77 U7.6 ; 41.29,27.67 v3(41.17,27.67) 43.58,27.67 44.47,28.56 44.47,29.45 43.55,30.36 U3.21
  Bottom Layer w0.254: v3(41.17,27.67) 33.17,35.67 30.88,35.67 27.07,39.48 12.97,39.48 11.96,40.5 v3(11.96,41.13)
TXD3: length 49.5
  Top Layer w0.254: U3.29 39.55,32.82 42.94,36.21 H1.4
  Bottom Layer w0.254: CN8.1 29.17,49.19 33.17,45.19 33.17,43.03 34.56,41.64 40.28,41.64 H1.4
VS: length 173.6
  Top Layer w0.508: CN8.4 13.93,55.68 10.05,51.8 10.05,33 12.85,30.21 12.85,27.54 14.5,25.89 14.5,20.43 J13.2
  Top Layer w2.54: P1.1 P2.3 J12.2 J11.2 J10.2 J9.2 80.92,42.53 82.19,42.15 82.95,41.77 83.71,41.13 84.47,40.11 84.6,37.7 83.46,35.92 81.93,35.54 80.66,35.42 J8.2 J7.2 J6.2 J5.2 J4.2 J3.2 J2.2 J1.2 65.55,10.14 62.88,10.52 59.96,9.51 59.07,8.11 59.07,6.59 57.55,5.06 J24.2 J23.2 J22.2 J21.2 J20.2 J19.2 J18.2 J17.2 30.58,5.32 28.75,5.69 28.21,6.97 27.58,8.62 26.56,9.63 24.53,9.89 23.13,9.51 20.97,9.76 J16.2 J15.2 J14.2 J13.2
XTAL1: length 5.6
  Top Layer w0.254: X1.3 51.74,24.39 U3.6
XTAL2: length 6.4
  Top Layer w0.254: U3.5 48.89,23.89 51.76,21.01 X1.1
$1N1558: length 24
  Top Layer w0.254: 31.62,57.97 30.68,57.97 30.12,58.53 30.12,60.81 32.28,62.97 35.83,62.97 36.98,64.12 D2.1
  Top Layer w1: L5.1 44.47,61.79 v2(44.47,63.23) ; D2.1 37.65,65.13 v2(40.4,65.13)
  Bottom Layer w1: v2(44.47,63.23) 42.56,65.13 v2(40.4,65.13)
$1N1869: length 5.1
  Top Layer w0.254: R6.1 35.45,54.99 U2.5
  Top Layer w1: R13.2 38.25,55.61 U2.5
$1N6800: length 2
  Top Layer w0.254: R1.1 PLED1.1
$1N8007: length 2.6
  Top Layer w0.5: USB.1 32.94,68.89 SS34.2
$1N8497: length 17.5
  Top Layer w0.254: USB.2 32.29,70.74 30.5,68.94 27.45,68.94 21.9,63.4 CH340C.6
$1N8517: length 15.8
  Top Layer w0.254: CH340C.5 22.24,64.5 27.2,69.45 30.37,69.45 31.64,70.72 USB.3
$1N28119: length 2.2
  Top Layer w0.254: R10.1 PLED2.1
$1N43465: length 4.8
  Top Layer w0.254: 18.31,44.31 18.31,42.96 20.14,41.13 U7.3
$1N43466: length 6.1
  Top Layer w0.254: U7.7 14.7,39.86 16.4,41.56 R11.1
$1N56275: length 7.5
  Top Layer w0.254: R20.1 64.53,18.42 J1.3
$1N57014: length 7.1
  Top Layer w0.254: R21.1 66.42,19.33 J2.3
$1N57327: length 6.2
  Top Layer w0.254: J3.3 68.2,20.34 R22.1
$1N58153: length 5.4
  Top Layer w0.254: 69.98,21.75 66.4,25.32 R23.1
$1N58157: length 5.7
  Top Layer w0.254: R24.1 69.45,27.1 J5.3
$1N58161: length 5.9
  Top Layer w0.254: R25.1 72.5,28.88 J6.3
$1N58832: length 6.3
  Top Layer w0.254: R26.1 75.07,30.66 J7.3
$1N58836: length 7.6
  Top Layer w0.254: R27.1 75.58,32.44 77.09,33.94
$1N58840: length 5.9
  Top Layer w0.254: 73,40.62 76.24,40.62 J9.3
$1N59511: length 5.6
  Top Layer w0.254: 71.98,42.4 75.1,45.51 J10.3
$1N59515: length 5.9
  Top Layer w0.254: 70.97,44.17 74.53,47.73 J11.3
$1N59519: length 6.8
  Top Layer w0.254: 69.95,45.95 72.75,48.75 J12.3
$1N61585: length 5.5
  Top Layer w0.254: J13.3 22.04,21.13 22.55,21.64
$1N61589: length 5.3
  Top Layer w0.254: 19.05,18.08 21.78,18.08 R33.1
$1N61593: length 5
  Top Layer w0.254: J15.3 23.88,18.08 R34.1
$1N61597: length 5.6
  Top Layer w0.254: 22.6,11.98 25.6,14.98 25.6,16.31
$1N61601: length 6.6
  Top Layer w0.254: R36.1 34.37,11.22 J17.3
$1N61605: length 6
  Top Layer w0.254: J18.3 36.4,9.7 R37.1
$1N61609: length 5.3
  Top Layer w0.254: J19.3 38.44,8.17 R38.1
$1N61613: length 5.5
  Top Layer w0.254: R39.1 41.42,11.74 J20.3
$1N61617: length 6.1
  Top Layer w0.254: R40.1 44.98,10.21 J21.3
$1N61621: length 6.7
  Top Layer w0.254: R41.1 48.53,8.69 J22.3
$1N61625: length 7.6
  Top Layer w0.254: R42.1 47,12.69 J23.3
$1N61629: length 9.2
  Top Layer w0.254: J24.3 50.56,12.69 R43.1
$1N67150: length 38
  Bottom Layer w2.54: SW1.3 46.6,75.55 62.42,75.55 66.16,73.25 69.61,66.62 P2.2

## Copper pours and planes (outline as drawn; the poured copper is in the pictures)
GND on Top Layer: -16.49,102.85 93.49,102.85 93.49,-18.69 -16.49,-18.69
GND on Bottom Layer: -5.82,82.91 100.98,82.91 100.98,-4.97 -5.82,-4.97

## Text on the board
Top Silkscreen Layer: 3.3V / GND | 5V / GND
